# Altium project Sistem Tasarim.PrjPcb
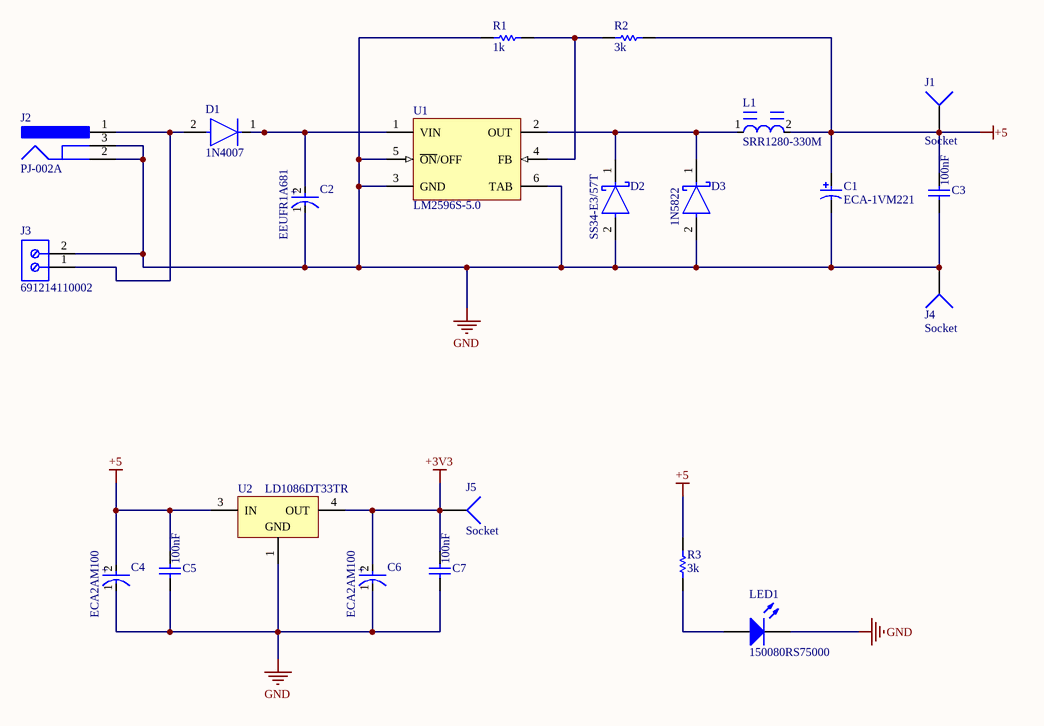
[diagram p0: Power_Supply.SchDoc]
8 sheets, 102 parts. Net scope: global (net labels, ports and power ports of the same name join across sheets).
Board file: Sistem Tasarim PCB.PcbDoc
Sheets:
  Power_Supply.SchDoc
  MCU.SchDoc
  Leds and Buttons.SchDoc
  Buzzer and Relay.SchDoc
  Distance and PhotoElectric.SchDoc
  ADC Channels.SchDoc
  Oled Display and Bluetooth Sensor.SchDoc
  DC Engine and Servo Engine.SchDoc

## Sheet Power_Supply.SchDoc
size A; SheetNumber: 1; SheetTotal: 8; SPICEModelCachePQJKFEOE: <root> / <DocumentId>PQJKFEOE</DocumentId> / </root>

### Parts
C1  ECA-1VM221  [PNSC-ECA-1VM221-2]
C2  EEUFR1A681  [FP-RAD-TH-D_8_0_5-L_11_5-MFG]
C3  value 100nF  [CAPC2013X135X45LL10T25]  (hidden comment: GRM21BR71H105KA12L)
C4  ECA2AM100  [FP-RAD-TH-D_5_0_5-L_11_1-MFG]
C5  value 100nF  [CAPC2013X135X45LL10T25]  (hidden comment: GRM21BR71H105KA12L)
C6  ECA2AM100  [FP-RAD-TH-D_5_0_5-L_11_1-MFG]
C7  value 100nF  [CAPC2013X135X45LL10T25]  (hidden comment: GRM21BR71H105KA12L)
D1  1N4007  [FP-1N4007-MFG]
D2  SS34-E3/57T  [FP-95402-MFG]
D3  1N5822  [FP-DO-201AD-MFG]
J1  Socket  [PIN1]
J2  PJ-002A  [CUI-PJ-002A_V]
J3  691214110002  [691214110002]
J4  Socket  [PIN1]
J5  Socket  [PIN1]
L1  SRR1280-330M  [FP-SRR1280-MFG]
LED1  150080RS75000  [0805_A]
R1  value 1k  [RESC2013X70X40NL20T20]  (hidden comment: ERJ6ENF47R0V)
R2  value 3k  [RESC2013X70X40NL20T20]  (hidden comment: ERJ6ENF47R0V)
R3  value 3k  [RESC2013X70X40NL20T20]  (hidden comment: ERJ6ENF47R0V)
U1  LM2596S-5.0  [KTT0005B_L]
U2  LD1086DT33TR  [TO-252_L]

### Nets
+3V3: C6.2(A) C7.2 J5.1 U2.4(OUT)
+5: C1.1 C3.2 C4.2(A) C5.2 J1.1 L1.2 R2.2 R3.2 U2.3(IN)
GND: C1.2 C2.1(C) C3.1 C4.1(C) C5.1 C6.1(C) C7.1 D2.2(A) D3.2(A) J2.2 J2.3 J3.2 J4.1 LED1.1(K) R1.1 U1.3(GND) U1.5(~{ON}/OFF) U1.6(TAB) U2.1(GND)
NetC2_2: C2.2(A) D1.1(C) U1.1(VIN)
NetD1_2: D1.2(A) J2.1 J3.1
NetD2_1: D2.1(C) D3.1(C) L1.1 U1.2(OUT)
NetLED1_2: LED1.2(A) R3.1
NetR1_2: R1.2 R2.1 U1.4(FB)

### Notes on the sheet
- (in symbol CMP-05427-000255-1) +
- (in symbol CMP-05427-000869-1) +

### Library data of the parts
C1 = CMP-2000-05311-1: Aluminum Electrolytic Capacitor, 220 uF, +/- 20%, 35 V, -40 to 85 degC, 2-Pin THD, RoHS, Bulk; Manufacturer: Panasonic; Lifetime@Temperature: 2000Hrs@85degC; Rated Voltage: 35V; Ripple Current: 350mA; Type: Radial; Capacitance: 220µF; Package Reference: ECA-1VM221; Series: M; Operating Temp Range: -40to+85degC; Package Description: 2-Pin Axial Lead, Dia 8 mm, Body Length 12.5 mm; Datasheet Version: Mar-06; Datasheet URL: https://datasheet.ciiva.com/26341/441851-da-01-en-elko-eca1vm221-m-r-220myf-35v-85c-26341906.pdf; Operating Temp-Max: 85degC; Case Size/Dimension: Ø8x11.5mm; Manufacturer URL: http://www.panasonic.com/
C2 = CMP-05427-000255-1: Aluminum Electrolytic Capacitors (Radial Lead Type) 680uF ±20% 10V; Ripple Current (AC): 950mA; Lead/Base Style: Straight; Lead Diameter: 0.6mm; Impedance: 56mR; Life (Hours): 6000Hour; Radiation Hardening: No; Height - Seated (Max): 0.512inch; Voltage Rating (DC): 10V; REACH SVHC: No SVHC; Termination: Radial; Length: 11.5mm; Series: FR; Packaging: Bulk; Lead Pitch: 3.5mm; Construction: RADIAL; Min Operating Temperature: -40°C; Height: 11.5mm; Contact Plating: Tin; Diameter: 8mm; Capacitance: 680uF; Max Operating Temperature: 105°C; Tolerance: 20%; Voltage: 10V; Package Quantity: 200; Case/Package: Radial; Voltage Rating: 10V; RoHS Compliant: Yes; Mount: Through Hole; ESR (Equivalent Series Resistance): 56mR; Ripple Current: 950mA; Lead Free: Lead Free; Number of Pins: 2
C3 C5 C7 = CMP-1036-04761-2: Manufacturer: Murata; Part Number: GRM21BR71H105KA12L
C4 C6 = CMP-05427-000869-1: Aluminum Electrolytic Capacitors (Radial Lead Type) 10uF ±20% 100V; Polarity: Polar; Lead Diameter: 0.5mm; Dissipation Factor: 0.1%; Leakage Current: 3uA; Dielectric Material: Aluminium; Ripple Current: 70mA; Life (Hours): 2000Hour; Lead/Base Style: Straight; Length: 11mm; Case/Package: Radial; Lead Pitch: 2mm; Contact Plating: Tin; RoHS Compliant: Yes; Radiation Hardening: No; Capacitance: 10uF; Max Operating Temperature: 85°C; Lead Free: Lead Free; Termination: Radial; Voltage Rating: 100V; Package Quantity: 200; Voltage: 100V; Construction: RADIAL; Height: 11mm; Min Operating Temperature: -40°C; Diameter: 5mm; REACH SVHC: No SVHC; Tolerance: 20%; Width: 5mm; Height - Seated (Max): 0.472inch; Mount: Through Hole; Series: M; Voltage Rating (DC): 100V; Packaging: Bulk; Ripple Current (AC): 70mA; Number of Pins: 2
D1 = CMP-123542-000001-1: Rectifier diode 1000 V 1 A DO-41, ,; Manufacturer: Diotec; Max Surge Forward Current: 27A; Forward Current: 1A; Max Junction Temp: +175°C; Reverse Voltage: 1000V; Value: 15pF; Peak Reverse Current: 5uA; Category: Diode; Temperature Range Low: -50°C; Automotive: No; Temperature: -50°C to +175°C; Lead Free: Yes; ComponentLink2Description: Datasheet; Max Repetitive Reverse Voltage: 1000V; ComponentLink2URL: https://datasheet.octopart.com/1N4007-Diotec-datasheet-62346875.pdf; Manufacturer Part Number: 1N4007; Device Class L3: Rectifier Diodes; Height: 2.8mm; Octopart: https://octopart.com/1n4007-diotec-4040411; Package: 1N4007; Temperature Range High: +175°C; Device Class L1: Discrete Semiconductors; Device Class L2: Diodes; RoHS: TRUE; Capacitance: 15pF; Ipc Land Pattern Name: DIOAD888W100L520D280
D2 = CMP-02539-000012-1: DIODE SCHOTTKY 40V 3A DO214AB; Manufacturer: Vishay; Max Junction Temp: +150°C; Peak Reverse Current: 0.5mA; Max Surge Forward Current: 100A; Standoff Height: 0mm; ComponentLink2Description: Datasheet; Device Class L3: Schottky Diodes; Height: 2.62mm; Max Repetitive Reverse Voltage: 40V; Lead Free: Yes; Package: 95402; Temperature Range High: +150°C; ComponentLink2URL: http://www.vishay.com/docs/88751/ss32.pdf; Temperature: -55°C to +150°C; Footprint Url: http://www.vishay.com/docs/95402/smc.pdf; Automotive: No; Forward Current: 3A; Category: Diode; Manufacturer Part Number: SS34-E3/57T; RoHS: TRUE; Device Class L2: Diodes; Mouser Description: Schottky Diodes & Rectifiers 3.0 Amp 40 Volt; Octopart: https://octopart.com/ss34-e3%2F57t-vishay-39552907; Temperature Range Low: -55°C; Device Class L1: Discrete Semiconductors; Digikey Description: DIODE SCHOTTKY 40V 3A DO214AB
D3 = CMP-12187-000025-1: DIODE SCHOTTKY 40V 3A DO201AD; Manufacturer: STMicroelectronics; Max Junction Temp: +150°C; Peak Reverse Current: 2mA; Max Surge Forward Current: 80A; Temperature Range High: +150°C; Automotive: No; RoHS: TRUE; ComponentLink2Description: Datasheet; Manufacturer Part Number: 1N5822; Lead Free: Yes; Octopart: https://octopart.com/1n5822-stmicroelectronics-323225; Device Class L2: Diodes; Max Repetitive Reverse Voltage: 40V; Temperature: to +150°C; Height: 5.3mm; Category: Diode; Digikey Description: DIODE SCHOTTKY 40V 3A DO201AD; ComponentLink2URL: https://www.st.com/resource/en/datasheet/1n5822.pdf; Device Class L3: Schottky Diodes; Device Class L1: Discrete Semiconductors; Forward Current: 3A; Mouser Description: Schottky Diodes & Rectifiers Vr/40V Io/3A BULK; Package: DO-201AD
J2 = CMP-2000-06895-2: Through Hole Right Angle DC Power Jack, 2.5 A, 2 mm Center Pin, 3 Position, -25 to 85 degC, RoHS, Bulk; Manufacturer: CUIInc.; Brand: CUI; Inside Contact Diameter: 2mm; Voltage Rating: 24V; Outside Contact Diameter: 6.5mm; Current Rating: 2.5A; Insulation Resistance: 50MOhms; Contact Gender: Male; Connector Type: DCPowerJack; Datasheet Version: Rev. 1.03, 04/2016; Housing Material: PolybutyleneTerephthalate(PBT); Operating Temperature Range: -25Cto+85C; Termination Style: ThroughHole; Product Category: DCPowerConnectors; Mounting Technology: ThroughHole; Mounting Style: ThroughHole; Factory Pack Quantity: 500; Contact Plating: Nickel; Package Reference: PJ-002A; Mounting Angle: Right; Package Description: 3-Pin Through Hole Device, Body 14.4 x 9 mm, Height 11 mm; Flammability Rating: UL94V-0; Manufacturer URL: http://www.cui.com/; Product: Jacks; Contact Material: Copper; Datasheet URL: http://www.cui.com/product/resource/pj-002a.pdf; RoHS: True
J3 = CMP-1502-02464-1: Serie 2141 - 3.50 mm Horizontal Entry Modular with Rising Cage Clamp WR-TBL, 2 pin; Manufacturer: Wurth Elektronik; Pin Number: 2; Pitch: 3.50mm; Datasheet URL: http://katalog.we-online.de/em/datasheet/6912141100xx.pdf; Packaging: Box; Mounting Technology: THT; Package Reference: 691214110002; Manufacturer URL: http://www.we-online.de; Part Number: 691214110002; Publisher: WurthElektronik; Operating Temperature: -40to105degC
L1 = CMP-2000-07148-2: FIXED IND 33UH 3.5A 57 MOHM SMD; Self Resonant Frequency: 9.5MHz; Saturation Current: 3.3A; Shielding: Shielded; Test Frequency: 100kHz; Core Material: Ferrite; Tolerance: 20%; Q Factor: 28; Resistance: 57MR; Material: Steel; RMS Current (Irms): 3.5A; Max DC Current: 3.5A; Height: 7.5mm; Frequency: 9.5MHz; Series: SRR1280; Length: 12.5mm; Military Standard: Not; Height - Seated (Max): 0.315inch; REACH SVHC: No SVHC; Inductance: 33uH; DC Current: 3.5A; Current Rating: 3.5A; Sample Rate (Hz): 100kHz; Min Operating Temperature: -40°C; RoHS Compliant: Yes; Width: 12.5mm; Packaging: Tape and Reel; Inductance Tolerance: 20%; Case/Package: Nonstandard; Radiation Hardening: No; Max Operating Temperature: 125°C; Number of Pins: 2; Depth: 12.8mm; Mount: Surface Mount; Termination: SMD/SMT; Package Quantity: 400; DC Resistance (DCR): 57mR; Resistor Type: Wirewound
LED1 = CMP-1426-00011-1: SMD mono-color Chip LED, WL-SMCW, Red; Manufacturer: Wuerth Elektronik; Color: Red; PartNumber: 150080RS75000; PackageReference: 0805_A; ComponentLink2Description: Datasheet; ComponentLink1URL: http://www.we-online.com; ComponentLink1Description: Manufacturer URL; ComponentLink2URL: http://katalog.we-online.com/led/datasheet/150080RS75000.pdf
R1-R3 = CMP-2001-00205-1: Manufacturer: Panasonic; Part Number: ERJ6ENF47R0V
U1 = CMP-0069-00270-3: SIMPLE SWITCHER® Power Converter 150 KHz 3A Step-Down Voltage Regulator, 5-pin TO-263; Manufacturer: Texas Instruments; PowerWise: N; PackageTopMarking: NSUZXYTTE#*LM2596S*-5.0 P+; RoHS: N; Code_JEDEC: MO-169-AB; PackageDescription: TO-263, Molded, .400 x .390 x .180in, 5 Lead, .067in Pitch, Surface Mount; PinCount: 5; PackageReference: KTT0005B; CompType: Switcher; ComponentLink1URL: http://www.ti.com/general/docs/lit/getliterature.tsp?genericPartNumber=LM2596&fileType=pdf; ComponentLink1Description: Datasheet URL
U2 = CMP-0244-00125-1: 1.5A, Low Drop Positive Voltage Regulator, 3.3V, 3-Pin DPAK, Tape and Reel; ComponentLink2URL: http://www.st.com/internet/com/TECHNICAL_RESOURCES/TECHNICAL_LITERATURE/DATASHEET/CD00001884.pdf; ComponentLink1URL: http://www.st.com; PackageReference: TO-252; ComponentLink1Description: Manufacturer URL; ComponentLink2Description: Datasheet; PackageVersion: 2011; PackageDescription: 3-Pin Transistor Outline Package 2.28 mm Pitch, 9.7 mm Lead Span (DPAK); DatasheetVersion: 11/07/2011
J1 J4 J5 = Socket: LatestRevisionDate: 17-Jul-2002; LatestRevisionNote: Re-released for DXP Platform.; Publisher: Altium Limited

## Sheet MCU.SchDoc
size A; SheetNumber: 2; SheetTotal: 8
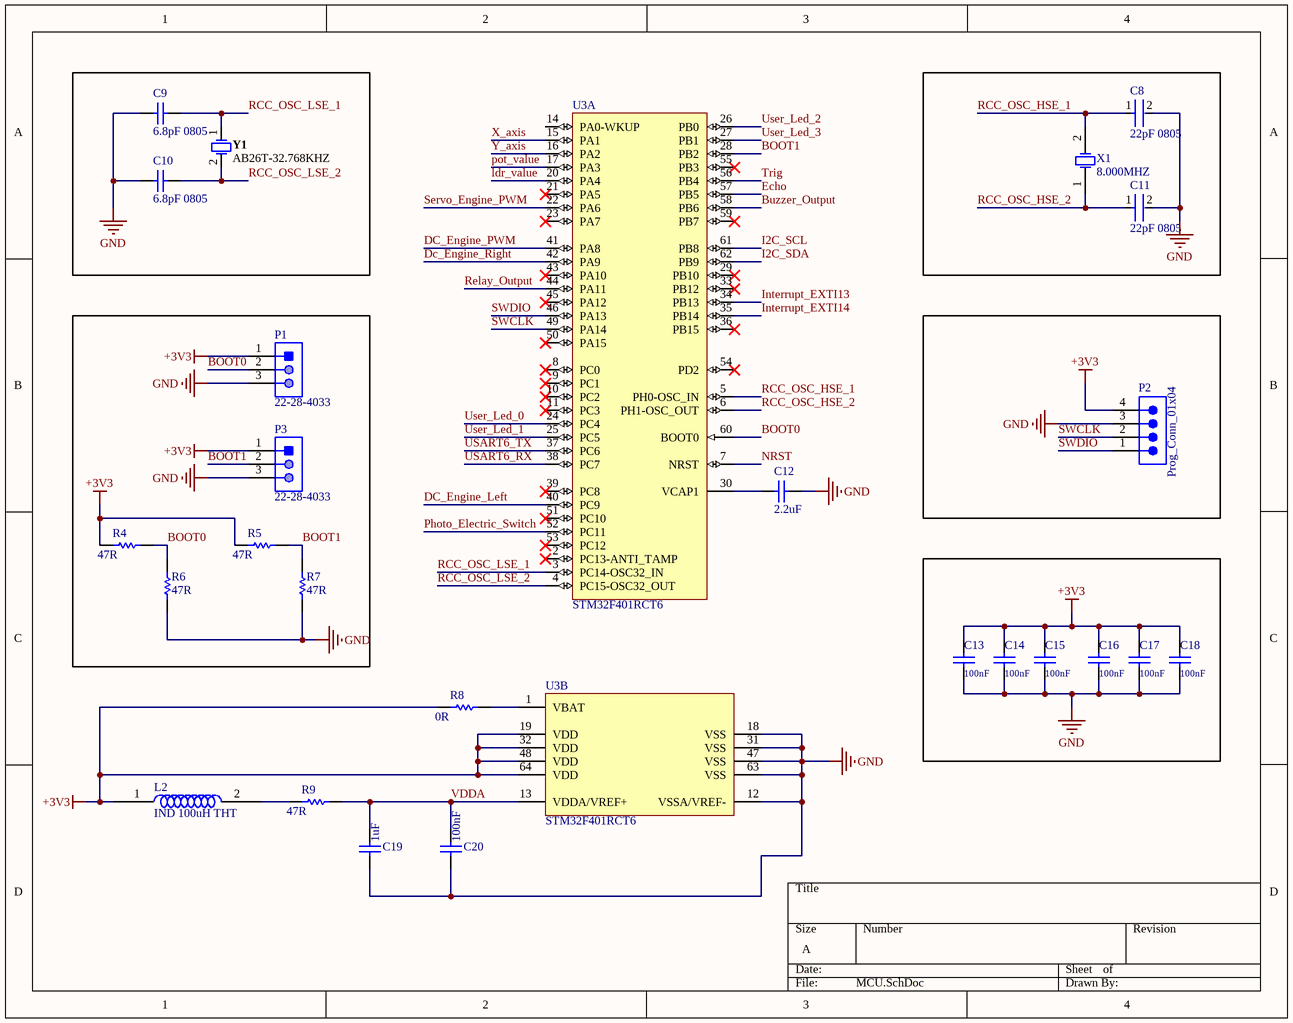
[diagram p1: MCU.SchDoc]

### Parts
C8  22pF 0805  [FP-C0805C-DN-MFG]
C9  6.8pF 0805  [CAPC0805(2012)75_N]
C10  6.8pF 0805  [CAPC0805(2012)75_N]
C11  22pF 0805  [FP-C0805C-DN-MFG]
C12  value 2.2uF  [CAPC2013X135X45LL10T25]  (hidden comment: GRM21BR71H105KA12L)
C13  value 100nF  [CAPC2013X135X45LL10T25]  (hidden comment: GRM21BR71H105KA12L)
C14  value 100nF  [CAPC2013X135X45LL10T25]  (hidden comment: GRM21BR71H105KA12L)
C15  value 100nF  [CAPC2013X135X45LL10T25]  (hidden comment: GRM21BR71H105KA12L)
C16  value 100nF  [CAPC2013X135X45LL10T25]  (hidden comment: GRM21BR71H105KA12L)
C17  value 100nF  [CAPC2013X135X45LL10T25]  (hidden comment: GRM21BR71H105KA12L)
C18  value 100nF  [CAPC2013X135X45LL10T25]  (hidden comment: GRM21BR71H105KA12L)
C19  value 1uF  [CAPC2013X135X45LL10T25]  (hidden comment: GRM21BR71H105KA12L)
C20  value 100nF  [CAPC2013X135X45LL10T25]  (hidden comment: GRM21BR71H105KA12L)
L2  IND 100uH THT  [INDUCTOR THT]
P1  22-28-4033  [MOLX-22-28-4033_V]
P2  Prog_Conn_01x04  [SMTC-TSW-104-08-X-S]
P3  22-28-4033  [MOLX-22-28-4033_V]
R4  value 47R  [RESC2013X70X40NL20T20]  (hidden comment: ERJ6ENF47R0V)
R5  value 47R  [RESC2013X70X40NL20T20]  (hidden comment: ERJ6ENF47R0V)
R6  value 47R  [RESC2013X70X40NL20T20]  (hidden comment: ERJ6ENF47R0V)
R7  value 47R  [RESC2013X70X40NL20T20]  (hidden comment: ERJ6ENF47R0V)
R8  value 0R  [RESC2013X70X40NL20T20]  (hidden comment: ERJ6ENF47R0V)
R9  value 47R  [RESC2013X70X40NL20T20]  (hidden comment: ERJ6ENF47R0V)
U3  STM32F401RCT6  [STM-LQFP64_N]  (parts A,B of 2)
X1  8.000MHZ  [ABRA-ABLS-14.7456MHZ-B2-T_V]
Y1  AB26T-32.768KHZ  [ABRA-AB26T]

### Nets
+3V3: C13.2 C14.2 C15.2 C16.2 C17.2 C18.2 L2.1 P1.1 P2.4 P3.1 R4.1 R5.1 R8.1 U3.19(VDD) U3.32(VDD) U3.48(VDD) U3.64(VDD)
GND: C8.2 C9.1 C10.1 C11.2 C12.1 C13.1 C14.1 C15.1 C16.1 C17.1 C18.1 C19.1 C20.1 P1.3 P2.3 P3.3 R6.1 R7.1 U3.12(VSSA/VREF-) U3.18(VSS) U3.31(VSS) U3.47(VSS) U3.63(VSS)
BOOT0: P1.2 R4.2 R6.2 U3.60(BOOT0)
BOOT1: P3.2 R5.2 R7.2 U3.28(PB2)
Buzzer_Output: U3.58(PB6)
DC_Engine_Left: U3.40(PC9)
DC_Engine_PWM: U3.41(PA8)
Dc_Engine_Right: U3.42(PA9)
Echo: U3.57(PB5)
I2C_SCL: U3.61(PB8)
I2C_SDA: U3.62(PB9)
Interrupt_EXTI13: U3.34(PB13)
Interrupt_EXTI14: U3.35(PB14)
ldr_value: U3.20(PA4)
NRST: U3.7(NRST)
Photo_Electric_Switch: U3.52(PC11)
pot_value: U3.17(PA3)
RCC_OSC_HSE_1: C8.1 U3.5(PH0-OSC_IN) X1.2(X2)
RCC_OSC_HSE_2: C11.1 U3.6(PH1-OSC_OUT) X1.1(X1)
RCC_OSC_LSE_1: C9.2 U3.3(PC14-OSC32_IN) Y1.1
RCC_OSC_LSE_2: C10.2 U3.4(PC15-OSC32_OUT) Y1.2
Relay_Output: U3.44(PA11)
Servo_Engine_PWM: U3.22(PA6)
SWCLK: P2.2 U3.49(PA14)
SWDIO: P2.1 U3.46(PA13)
Trig: U3.56(PB4)
USART6_RX: U3.38(PC7)
USART6_TX: U3.37(PC6)
User_Led_0: U3.24(PC4)
User_Led_1: U3.25(PC5)
User_Led_2: U3.26(PB0)
User_Led_3: U3.27(PB1)
VDDA: C19.2 C20.2 R9.2 U3.13(VDDA/VREF+)
X_axis: U3.15(PA1)
Y_axis: U3.16(PA2)
NetC12_2: C12.2 U3.30(VCAP1)
NetL2_2: L2.2 R9.1
NetR8_2: R8.2 U3.1(VBAT)

Not connected (* = marked no-connect by the designer): U3 2(PC13-ANTI_TAMP)* 8(PC0)* 9(PC1)* 10(PC2)* 11(PC3)* 14(PA0-WKUP) 21(PA5)* 23(PA7)* 29(PB10)* 33(PB12)* 36(PB15)* 39(PC8)* 43(PA10)* 45(PA12)* 50(PA15)* 51(PC10)* 53(PC12)* 54(PD2)* 55(PB3)* 59(PB7)*

### Library data of the parts
C8 C11 = CMP-2007-00466-2: CAP CER 22PF 50V 10% NP0 0805; Manufacturer Part Number: C0805C220K5GACTU; Manufacturer: KEMET; Material: Ceramic; Tolerance: 0.1; Temperature Coefficient: 30ppm/°C; Temperature Characteristic: C0G; Lead Free: Yes; Device Class L2: Capacitors; Voltage Rating: 50 V; Package: C0805C-DN; Mouser Description: Multilayer Ceramic Capacitors MLCC - SMD/SMT 50volts 22pF C0G 10%; ComponentLink2URL: https://content.kemet.com/datasheets/KEM_C1003_C0G_SMD.pdf; Ipc Land Pattern Name: CAPC200125X78; Capacitance: 22 pF; Temperature Range Low: -55°C; Device Class L1: Passive Components; Octopart: https://octopart.com/c0805c220k5gactu-kemet-9138623; ComponentLink2Description: Datasheet; Device Class L3: Ceramic Capacitors; Temperature Range High: +125°C; Height: 0.88mm; RoHS: TRUE; Temperature: -55°C to +125°C; Category: Cap; Automotive: No; Digikey Description: CAP CER 22PF 50V 10% NP0 0805; Value: 22 pF
C9 C10 = CMP-1036-00687-1: CAP 6.8pF 25V ±0.25pF 0805 (2012 Metric) Thickness 0.75mm SMD; Tolerance: Â±0.25pF; Case-EIA: 0805; Case-Metric: 2012; Value: 6.8pF; Technology: SMT; Max Thickness: 0.75 mm; Rated Voltage: 25 V
C12-C20 = CMP-1036-04761-2: Manufacturer: Murata; Part Number: GRM21BR71H105KA12L
L2 = IND 100uH THT: Fixed Ind 100uH THT
P1 P3 = CMP-1676-00001-5: Male Header, Pitch 2.54 mm, 1 x 3 Position, Height 8.38 mm, Tail Length 3.18 mm, RoHS, Bulk; Manufacturer: Molex; Rows: 1; Voltage Rating: 250 V; Current Rating: 4 A; Min Operating Temperature: 0 degC; Lead Pitch: 0.1 inch; Packaging: Bulk; Contact Finish: Gold; RoHSCompliant: true; Contact Material: Brass; PackageReference: 22-28-4033; REACH SVHC: Unknown; PackageDescription: Male Header, Pitch 2.54 mm, 1 x 3 Position, Height 8.38 mm, Tail Length 3.18 mm; ComponentLink2URL: http://www.molex.com/pdm_docs/sd/022284033_sd.pdf; Height: 8.38 mm; Mounting Technology: Through Hole; ComponentLink1Description: Manufacturer URL; Length: 7.62 mm; Mount: Through Hole; DatasheetVersion: Rev. G, 01/2012; Max Operating Temperature: 75 degC; ComponentLink2Description: Datasheet; Colour: Black; Pins: 3; Contact Plating: Gold; Package Quantity: 1; ComponentLink1URL: http://www.molex.com/
P2 = CMP-1024-00356-1: 0.025" SQ Post Header, Through-hole, Vertical, -55 to 105 degC, 2.54 mm Pitch, 4-Pin, Male, RoHS; PartNumber: TSW-104-08-T-S; Manufacturer: Samtec; Pitch: 2.54 mm; PackageDescription: .025[0.64] SQ. Post Terminal Strip Assembly; ComponentLink2URL: http://www.samtec.com/documents/webfiles/pdf/TSW_TH.PDF; ComponentLink3URL: http://www.samtec.com/documents/webfiles/cpdf/TSW-XXX-XX-XXX-X-XX-XXX-MKT.pdf; PackageVersion: DM, 8/1988; ComponentLink3Description: Package Specification; DatasheetVersion: F-214; Orientation: Vertical; RoHS: True; Mounting Technology: Through-hole; ComponentLink1URL: http://www.samtec.com; ComponentLink1Description: Manufacturer URL; Temperature Range: -55 to 105 degC; ComponentLink2Description: Datasheet; PackageReference: TSW-104-08-X-S
R4-R9 = CMP-2001-00205-1: Manufacturer: Panasonic; Part Number: ERJ6ENF47R0V
U3 = CMP-0243-00091-2: ARM Cortex-M4 32-bit MCU+FPU, 105 DMIPS, 256 kB Flash, 64 kB Internal RAM, 48 I/Os, 64-pin LQFP, -40 to 85 degC, Tray; Manufacturer: STMicroelectronics; Internal RAM Size (kB): 64; Supply Voltage(Vcc) max (V): 3.6; FLASH Size (Prog) (kB): 256; I/Os (High Current): 48; Operating Frequency(F) (Processor speed) (MHz): 84; Supply Voltage(Vcc) min (V): 1.8; DatasheetVersion: Rev. 1; ComponentLink1URL: http://www.st.com/web/en/home.html; ComponentLink1Description: Manufacturer URL; PackageDescription: 64-Pin Low Profile Quad Flat Package, 10 x 10 mm Body, 0.5 mm Pitch; Packing: Tray; ComponentLink3URL: http://www.st.com/st-web-ui/static/active/en/resource/technical/document/datasheet/DM00037051.pdf; PackageVersion: Rev. 4, 06/2013; ComponentLink2URL: http://www.st.com/st-web-ui/static/active/en/resource/technical/document/data_brief/DM00071938.pdf; PartNumber: STM32F401RCT6; PackageReference: LQFP64; Mounting Technology: Surface Mount; ComponentLink2Description: Datasheet; ComponentLink3Description: Package Specification; Core: ARM Cortex-M4
X1 = CMP-2000-05726-1: Low Profile Crystal, 8.0 MHz, +/- 30 ppm, -20 to 70 degC, 2-Pin SMD, RoHS, Tape and Reel; Brand: ABRACON; Case Length: 11.4mm; Frequency Stability: 50PPM; ESR: 80Ohms; Case Height: 4.2mm; Tolerance: 30PPM; Frequency: 8MHz; Case Width: 4.7mm; Load Capacitance: 18pF; Datasheet Version: 04/2011; Termination Style: SMD/SMT; Dimensions: 4.7mmWx11.4mmLx4.2mmH; Packaging: Reel; Manufacturer: ABRACON; Package URL: http://www.abracon.com/Support/PackageDrawing/Resonators/ABLS-2D.pdf; Mounting Technology: SurfaceMount; Package Reference: ABLS-14.7456MHZ-B2-T; Product Category: Crystals; Package Description: 2-Pin Surface Mount Device, Body 11.4 x 4.7 mm; Package / Case: HC-49/US; Mounting Style: SMD/SMT; Operating Temperature Range: -20Cto+70C; Series: ABLS; Factory Pack Quantity: 1000; Datasheet URL: http://www.abracon.com/Resonators/abls.pdf; Manufacturer URL: http://www.abracon.com/; RoHS: Details; Type: LowProfileMicroprocessorCrystal
Y1 = CMP-2000-05723-1: Crystal, 12.5 pF, 32.768 KHz, -10 to 60 degC, 2-Pin THD, RoHS, Bulk; Manufacturer: ABRACON; ESR: 35kOhms; Frequency Stability: -0.034PPM; Load Capacitance: 12.5pF; Tolerance: 20PPM; Case Length: 6.2mm; Case Diameter: 2.1mm; RoHS: Details; Product Category: Crystals; Type: WatchCrystal; Manufacturer URL: http://www.abracon.com/; Operating Temperature Range: -10Cto+60C; Package Description: 2-Pin Through Hole Device, Dia 2.1 mm, Body Length 6.2 mm; Termination Style: Radial; Datasheet Version: 06/2010; Datasheet URL: http://www.abracon.com/Resonators/AB26T.pdf; Packaging: Bulk; Factory Pack Quantity: 500; Brand: ABRACON; Mounting Technology: ThroughHole; Package URL: http://www.abracon.com/Support/PackageDrawing/Resonators/AB26T.PDF; Package / Case: Cylinder; Lead Spacing: 0.8mm; Dimensions: 2.1mmDia.x6.2mmL; Mounting Style: ThroughHole; Frequency: 32.768kHz; Package Reference: AB26T; Series: AB26T

## Sheet Leds and Buttons.SchDoc
size A; SheetNumber: 3; SheetTotal: 7
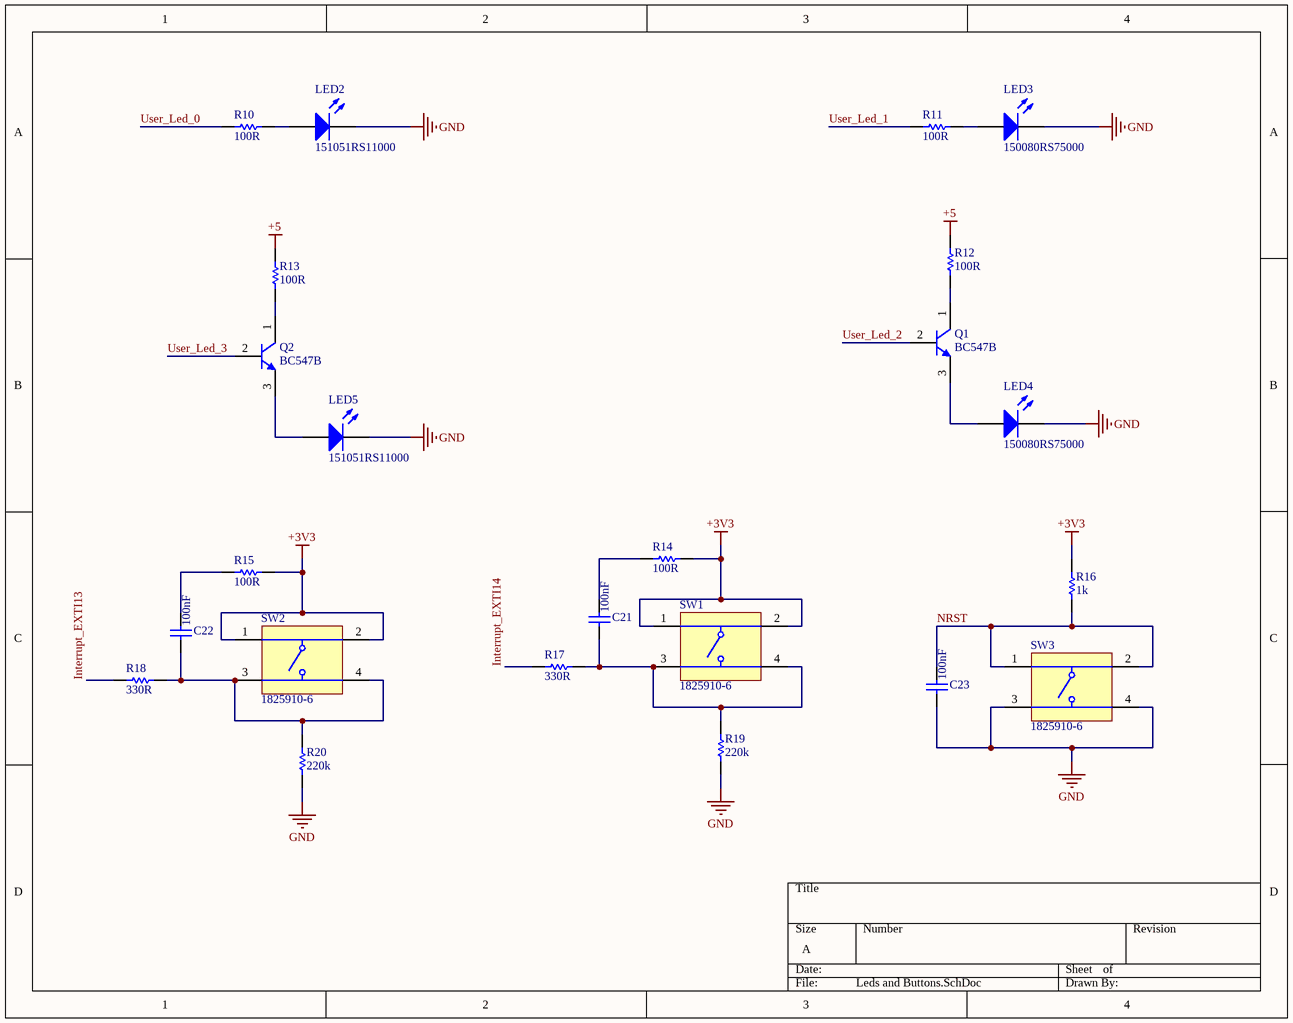
[diagram p2: Leds and Buttons.SchDoc]

### Parts
C21  value 100nF  [CAPC2013X135X45LL10T25]  (hidden comment: GRM21BR71H105KA12L)
C22  value 100nF  [CAPC2013X135X45LL10T25]  (hidden comment: GRM21BR71H105KA12L)
C23  value 100nF  [CAPC2013X135X45LL10T25]  (hidden comment: GRM21BR71H105KA12L)
LED2  151051RS11000  [Type 5mm]
LED3  150080RS75000  [0805_A]
LED4  150080RS75000  [0805_A]
LED5  151051RS11000  [Type 5mm]
Q1  BC547B  [ONSC-TO-92-3-29-11]
Q2  BC547B  [ONSC-TO-92-3-29-11]
R10  value 100R  [RESC2013X70X40NL20T20]  (hidden comment: ERJ6ENF47R0V)
R11  value 100R  [RESC2013X70X40NL20T20]  (hidden comment: ERJ6ENF47R0V)
R12  value 100R  [RESC2013X70X40NL20T20]  (hidden comment: ERJ6ENF47R0V)
R13  value 100R  [RESC2013X70X40NL20T20]  (hidden comment: ERJ6ENF47R0V)
R14  value 100R  [RESC2013X70X40NL20T20]  (hidden comment: ERJ6ENF47R0V)
R15  value 100R  [RESC2013X70X40NL20T20]  (hidden comment: ERJ6ENF47R0V)
R16  value 1k  [RESC2013X70X40NL20T20]  (hidden comment: ERJ6ENF47R0V)
R17  value 330R  [RESC2013X70X40NL20T20]  (hidden comment: ERJ6ENF47R0V)
R18  value 330R  [RESC2013X70X40NL20T20]  (hidden comment: ERJ6ENF47R0V)
R19  value 220k  [RESC2013X70X40NL20T20]  (hidden comment: ERJ6ENF47R0V)
R20  value 220k  [RESC2013X70X40NL20T20]  (hidden comment: ERJ6ENF47R0V)
SW1  1825910-6  [TECO-1825910-6_V]
SW2  1825910-6  [TECO-1825910-6_V]
SW3  1825910-6  [TECO-1825910-6_V]

### Nets
+3V3: R14.2 R15.2 R16.2 SW1.1 SW1.2 SW2.1 SW2.2
+5: R12.1 R13.1
GND: C23.1 LED2.1(K) LED3.1(K) LED4.1(K) LED5.1(K) R19.1 R20.1 SW3.3 SW3.4
Interrupt_EXTI13: R18.1
Interrupt_EXTI14: R17.1
NRST: C23.2 R16.1 SW3.1 SW3.2
User_Led_0: R10.1
User_Led_1: R11.1
User_Led_2: Q1.2(B)
User_Led_3: Q2.2(B)
NetC21_1: C21.1 R17.2 R19.2 SW1.3 SW1.4
NetC21_2: C21.2 R14.1
NetC22_1: C22.1 R18.2 R20.2 SW2.3 SW2.4
NetC22_2: C22.2 R15.1
NetLED2_2: LED2.2(A) R10.2
NetLED3_2: LED3.2(A) R11.2
NetLED4_2: LED4.2(A) Q1.3(E)
NetLED5_2: LED5.2(A) Q2.3(E)
NetQ1_1: Q1.1(C) R12.2
NetQ2_1: Q2.1(C) R13.2

### Library data of the parts
C21-C23 = CMP-1036-04761-2: Manufacturer: Murata; Part Number: GRM21BR71H105KA12L
LED2 LED5 = CMP-1488-00008-1: THT LED round mono-color color lens, WL-TMRW, Red; Manufacturer: Wuerth Elektronik; PackageReference: Type 5mm; PartNumber: 151051RS11000; ComponentLink2URL: http://katalog.we-online.de/pbs/datasheet/7448042001.pdfhttp://katalog.we-online.de/pbs/datasheet/7448042001.pdfhttp://katalog.we-online.de/pbs/datasheet/7448042001.pdfhttp://katalog.we-online.de/pbs/datasheet/151051RS11000.pdf; ComponentLink1URL: http://www.we-online.com; ComponentLink1Description: Manufacturer URL; ComponentLink2Description: Datasheet; Emitting color: Red
LED3 LED4 = CMP-1426-00011-1: as LED1 on sheet Power_Supply; Color: Red; PartNumber: 150080RS75000; PackageReference: 0805_A; ComponentLink2Description: Datasheet; ComponentLink1URL: http://www.we-online.com; ComponentLink1Description: Manufacturer URL; ComponentLink2URL: http://katalog.we-online.com/led/datasheet/150080RS75000.pdf
Q1 Q2 = CMP-1048-01467-1: Amplifier Transistor, NPN Silicon, 3-Pin TO-92, Bulk Box; Manufacturer: On Semiconductor; IC Continuous (A): 0.1; fT Min (MHz): 150; DatasheetVersion: Rev. 7; ComponentLink1URL: http://www.onsemi.com/; Polarity: NPN; RoHS: FALSE; ComponentLink1Description: Manufacturer URL; Packing: Bulk Box; PackageDescription: 3-Pin Transistor Outline, Body 4.825 x 3.685 mm, Pitch 1.27 mm; ComponentLink3URL: http://www.onsemi.cn/pub_link/Collateral/2N6426-D.PDF; ComponentLink2Description: Datasheet; PackageVersion: Rev. AM; PackageReference: TO-92-3-29-11_AM_SL; ComponentLink3Description: Package Specification; Mounting Technology: Through Hole; PartNumber: BC547B; ComponentLink2URL: http://www.onsemi.com/pub_link/Collateral/BC546-D.PDF
R10-R20 = CMP-2001-00205-1: Manufacturer: Panasonic; Part Number: ERJ6ENF47R0V
SW1-SW3 = CMP-1684-00021-1: Tact Switch, SPST-NO, 0.05 A, -35 to 85 degC, 4-Pin THD, RoHS, Bulk; Manufacturer: TE Connectivity; Maximum Contact Resistance: 100mOhm; Mechanical Life: 100000Cycles; Bushing Type: Unthreaded; Switch Configuration: OFF(ON); Maximum DC Voltage Rating: 24V; Contact Rating @ Voltage: 0.05A@24VDC; Actuator Color: Black; Body Orientation: Straight; Function: MomentaryContact; Illumination: N/R; Actuator Style: RoundButton; Actuator Material: PolybutyleneTerephthalate; Dielectric Strength: 500VAC; Pole Throw Configuration: SPST; Actuator Length: 1.4mm; Product Weight: N/A; Contact Material: CopperAlloy; Housing Material: N/A; Terminal Type: PCPins; Minimum Insulation Resistance: 100MOhm; Package Description: 4-Pin Through Hole Device, Body 5.99 x 5.99 mm, Pitch 6.5 mm; Part No: 1825910-6; Package Reference: THD; Base Material: N/A; Manufacturer URL: http://www.te.com; Contact Plating: Silver; RoHS: Yes; Datasheet Version: Rev. C9; Electrical Life: 100000Cycles; Maximum AC Voltage Rating: N/A; Thread Size: N/R; Operating Temperature: -35to85C; Mounting: ThroughHole; Dimension: 5.99x5mm; Datasheet URL: http://www.te.com/commerce/DocumentDelivery/DDEController?Action=showdoc&DocId=Customer+Drawing%7F1825910%7FC9%7Fpdf%7FEnglish%7FENG_CD_1825910_C9.pdf%7F1825910-6; Family: 1825910; Seal Location: N/A; Seal Description: N/A; Packaging: N/A

## Sheet Buzzer and Relay.SchDoc
size A; SheetNumber: 4; SheetTotal: 8; SPICEModelCacheVCIOZCSS: <root> / <DocumentId>VCIOZCSS</DocumentId> / </root>
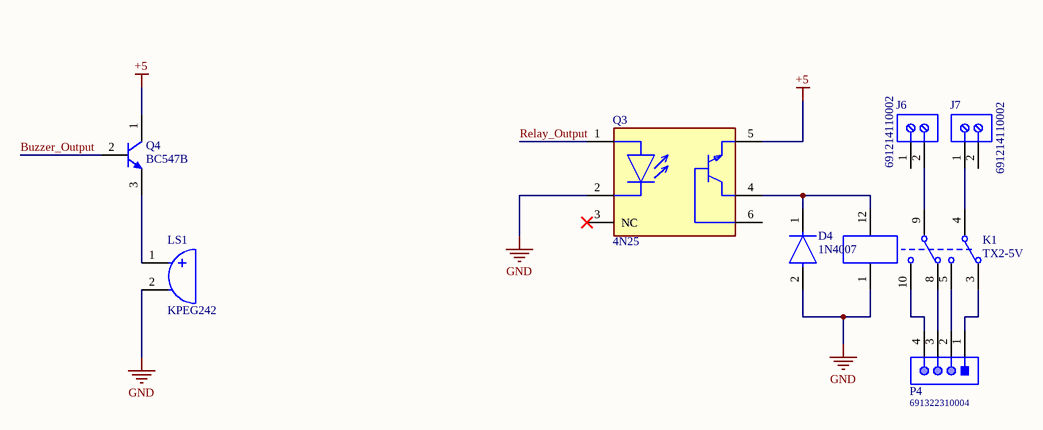
[diagram p3: Buzzer and Relay.SchDoc]

### Parts
D4  1N4007  [FP-1N4007-MFG]
J6  691214110002  [691214110002]
J7  691214110002  [691214110002]
K1  TX2-5V  [PNSC-TX2-5V_V]
LS1  KPEG242  [KINGS-KPEG242-2]
P4  691322310004  [691322310004]
Q3  4N25  [FP-4N25-MFG]
Q4  BC547B  [ONSC-TO-92-3-29-11]

### Nets
+5: Q3.5(C) Q4.1(C)
GND: D4.2(A) K1.1 LS1.2 Q3.2(C)
Buzzer_Output: Q4.2(B)
Relay_Output: Q3.1(A)
NetD4_1: D4.1(C) K1.12 Q3.4(E)
NetJ6_2: J6.2 K1.9
NetJ7_1: J7.1 K1.4
NetK1_3: K1.3 P4.1
NetK1_5: K1.5 P4.2
NetK1_8: K1.8 P4.3
NetK1_10: K1.10 P4.4
NetLS1_1: LS1.1 Q4.3(E)

Not connected (* = marked no-connect by the designer): J6 1; J7 2; Q3 3(NC)* 6(B)

### Library data of the parts
D4 = CMP-123542-000001-1: as D1 on sheet Power_Supply; Category: Diode; Temperature Range Low: -50°C; Automotive: No; Temperature: -50°C to +175°C; Lead Free: Yes; ComponentLink2Description: Datasheet; Max Repetitive Reverse Voltage: 1000V; ComponentLink2URL: https://datasheet.octopart.com/1N4007-Diotec-datasheet-62346875.pdf; Manufacturer Part Number: 1N4007; Device Class L3: Rectifier Diodes; Height: 2.8mm; Octopart: https://octopart.com/1n4007-diotec-4040411; Package: 1N4007; Temperature Range High: +175°C; Device Class L1: Discrete Semiconductors; Device Class L2: Diodes; RoHS: TRUE; Capacitance: 15pF; Ipc Land Pattern Name: DIOAD888W100L520D280
J6 J7 = CMP-1502-02464-1: as J3 on sheet Power_Supply; Datasheet URL: http://katalog.we-online.de/em/datasheet/6912141100xx.pdf; Packaging: Box; Mounting Technology: THT; Package Reference: 691214110002; Manufacturer URL: http://www.we-online.de; Part Number: 691214110002; Publisher: WurthElektronik; Operating Temperature: -40to105degC
K1 = CMP-2000-07334-1: 2000 V AC Breakdown Voltage, 2 Form C and 2 A Relay, Coil Votage 5 V, 28.1 mA, 178 Ohm, 140 mW, -40 to 85 degC, 8-Pin THD, RoHS, Tube; Manufacturer: Panasonic; Coil Resistance: 178ohm; Contact Current Min: 10µA; Coil Operating Upper Percent Limit: 150%; Approval Category: EN41003; Coil Voltage VDC Nom: 5V; External Width: 7.4mm; Nom Operating Power: 140mW; Approval Bodies: CSA/UL; Contact Current DC Max: 2A; Contact Voltage DC Nom: 30V; Coil Current: 28.1mA; Contact Voltage AC Max: 125V; Operating Time: 4ms; Contact Configuration: DPCO; Contact Current AC Max: 500mA; Relay Type: GeneralPurpose; External Height: 15mm; Contact Voltage AC Nom: 250V; External Depth: 8.2mm; PCB Hole Diameter: 1mm; No. of Poles: 2; Relay Mounting: ThroughHole; SVHC: NoSVHC(19-Dec-2012); Coil Type: DC; Coil Operating Lower Percent Limit: 75%; Manufacturer URL: http://www.panasonic.com/; Contact Material: SilverAlloy,GoldClad; Mounting Type: PCB; Package Reference: TX2-5V; Operating Temperature Min: -40°C; Datasheet URL: http://www3.panasonic.biz/ac/e_download/control/relay/signal/catalog/mech_eng_tx.pdf?f_cd=302302; Contact Voltage DC Max: 30V; Contact Current Max: 2A; Operating Temperature Max: 85°C; Coil Power Cont: 140mW; Contact Plating: Gold; DC Coil Power: 140mW; Datasheet Version: 07/2014; Package Description: 8-Pin Through Hole Relay, Body 15 x 7.4 mm; External Length / Height: 15mm; Mounting Technology: ThroughHole; Lead Spacing: 2.54mm
LS1 = CMP-2000-06518-1: Piezo Indicator, 4100 Hz, 3 to 16 V, -20 to 70 degC, 2-Pin THD, RoHS; PartNumber: KPE-242; Manufacturer: KingstateElectronicsCorp.; Frequency Range: 3600to4600Hz; Maximum Supply Current: 7mA; Typical Operating Supply Voltage: 12Vdc; Product Height: 7.6mm; Current - Max: 7A; Tone Mode: Continuous; Product Diameter: 13.7mm; Minimum Sound Pressure: 70dBA; Maximum Resonant Frequency: 4600Hz; Type: Indicator; Datasheet URL: https://datasheet.ciiva.com/11776/0900766b8068f3a2-11776713.pdf; Mounting: ThroughHole; Technology: Piezo; Operating Temperature: -20to70°C; Category: AudioIndicatorsandAlerts; Termination Method: Pin; Manufacturer URL: http://www.kingstate.com.tw/index.php/en/; Package Description: 2-Pin Through Hole Device, Body Dia 13.7 mm, Pitch 7.62 mm; Datasheet Version: 01/2006; Package Reference: KPEG242; Mounting Technology: ThroughHole
P4 = CMP-1502-01888-1: Serie 322 - 3.81mm Horizontal PCB Header WR-TBL, 4 pin; Manufacturer: Wurth Elektronik; Gender: Male; Pin Number: 4; Package Reference: 691322310004; Part Number: 691322310004; Publisher: WurthElektronik; Packaging: Box; Mounting Technology: THT; Manufacturer URL: http://www.we-online.de; Operating Temperature: -40to105degC; Pitch: 3.81mm; Datasheet URL: http://katalog.we-online.de/em/datasheet/6913223100xx.pdf
Q3 = CMP-22018-000009-1: OPTOISO 2.5KV TRANS W/BASE 6DIP; Isolation Voltage: 5kV; Reverse Breakdown Voltage: 5V; Forward Voltage: 1.5V; Rise Time: 2us; Max Power Dissipation: 250mW; Collector Emitter Breakdown Voltage: 30V; Max Collector Current: 100mA; Collector Emitter Saturation Voltage: 500mV; Power Dissipation: 150mW; Number of Elements: 1; Forward Current: 60mA; Output Voltage: 70V; Input Type: DC; Max Input Current: 80mA; Input Current: 50mA; Current Transfer Ratio: 50%; Number of Pins: 6; Min Operating Temperature: -55°C; Radiation Hardening: No; Case/Package: PDIP; Fall Time: 2us; Lead Free: Lead Free; Series: -; Max Operating Temperature: 100°C; Output Current per Channel: 100mA; Number of Circuits: 1; Collector Emitter Voltage (VCEO): 30V; Isolation Voltage-Max: 5kV; Collector-emitter Voltage-Max: 500mV; Packaging: Rail/Tube; Mount: Through Hole; Package Quantity: 2000; Max Output Voltage: 30V; Number of Channels: 1
Q4 = CMP-1048-01467-1: as Q1 on sheet Leds and Buttons; DatasheetVersion: Rev. 7; ComponentLink1URL: http://www.onsemi.com/; Polarity: NPN; RoHS: FALSE; ComponentLink1Description: Manufacturer URL; Packing: Bulk Box; PackageDescription: 3-Pin Transistor Outline, Body 4.825 x 3.685 mm, Pitch 1.27 mm; ComponentLink3URL: http://www.onsemi.cn/pub_link/Collateral/2N6426-D.PDF; ComponentLink2Description: Datasheet; PackageVersion: Rev. AM; PackageReference: TO-92-3-29-11_AM_SL; ComponentLink3Description: Package Specification; Mounting Technology: Through Hole; PartNumber: BC547B; ComponentLink2URL: http://www.onsemi.com/pub_link/Collateral/BC546-D.PDF

## Sheet Distance and PhotoElectric.SchDoc
size A; SheetNumber: 5; SheetTotal: 7
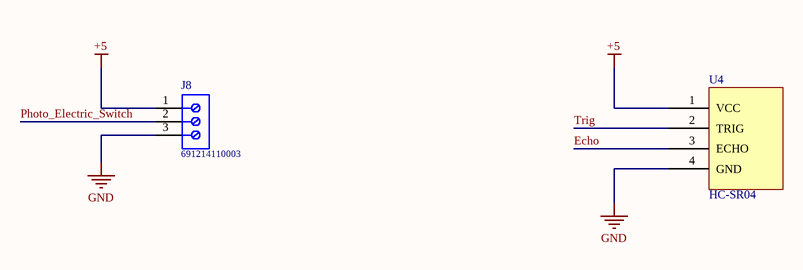
[diagram p4: Distance and PhotoElectric.SchDoc]

### Parts
J8  691214110003  [691214110003]
U4  HC-SR04  [HC-SR04]

### Nets
+5: J8.1 U4.1(VCC)
GND: J8.3 U4.4(GND)
Echo: U4.3(ECHO)
Photo_Electric_Switch: J8.2
Trig: U4.2(TRIG)

### Library data of the parts
J8 = CMP-1502-02466-1: Serie 2141 - 3.50 mm Horizontal Entry Modular with Rising Cage Clamp WR-TBL, 3 pin; Manufacturer: Wurth Elektronik; Pin Number: 3; Pitch: 3.50mm; Package Reference: 691214110003; Mounting Technology: THT; Part Number: 691214110003; Manufacturer URL: http://www.we-online.de; Packaging: Box; Operating Temperature: -40to105degC; Publisher: WurthElektronik; Datasheet URL: http://katalog.we-online.de/em/datasheet/6912141100xx.pdf
U4 = HC - SR04: 5V 15mA Distance Sensor THT Arduino Sensor

## Sheet ADC Channels.SchDoc
size A; SheetNumber: 6; SheetTotal: 8
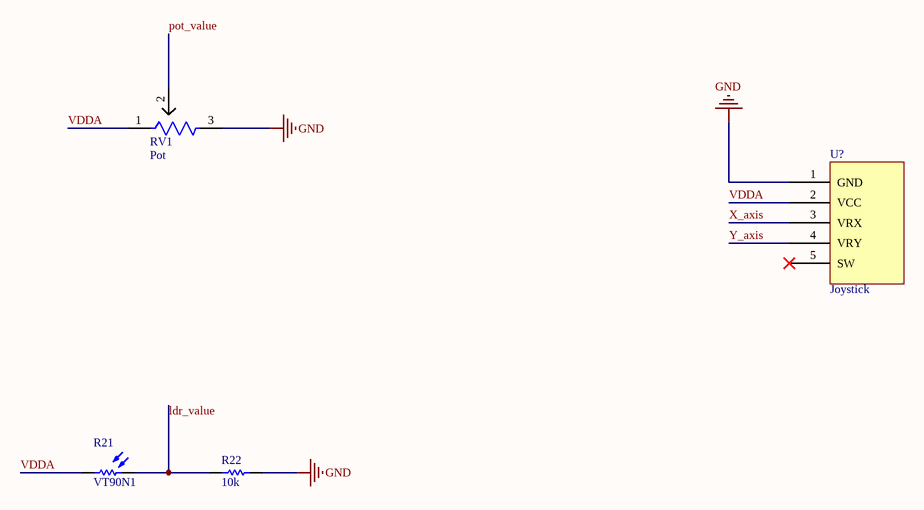
[diagram p5: ADC Channels.SchDoc]

### Parts
R21  VT90N1  [EXCE-VT90N1]
R22  value 10k  [RESC2013X70X40NL20T20]  (hidden comment: ERJ6ENF47R0V)
RV1  Pot  [Potansiyometre]
U?  Joystick  [Joystick]

### Nets
GND: R22.1 RV1.3 U?.1(GND)
ldr_value: R21.2 R22.2
pot_value: RV1.2
VDDA: R21.1 RV1.1 U?.2(VCC)
X_axis: U?.3(VRX)
Y_axis: U?.4(VRY)

Not connected (* = marked no-connect by the designer): U? 5(SW)*

### Library data of the parts
R21 = CMP-2000-07406-1: Photoconductive Resistor, 200 kOhm, 100 V, 80 mW, -40 to 75 degC, 2-Pin THD, RoHS; Manufacturer: Excelitas Technology; SVHC: Cadmiumchloride(15-Jun-2015); Power Rating: 80mW; Resistance @ Lux: 12kohm; Voltage Rating: 100V; Product Range: -; Datasheet Version: 09/2006; Resistor Case Style: -; Operating Temperature Max: 75°C; Package Reference: VT90N1; Datasheet URL: http://datasheet.octopart.com/VT90N1-Excelitas-datasheet-10388451.pdf; Mounting Technology: ThroughHole; Operating Temperature Min: -40°C; Dark Resistance: 200kohm; Package Description: 2-Pin Through Hole Device, Body Width 4.17 mm (Max), Height 2.29 mm; Manufacturer URL: http://www.excelitas.com/Pages/Index.aspx; Packaging: Each
R22 = CMP-2001-00205-1: Manufacturer: Panasonic; Part Number: ERJ6ENF47R0V
RV1 = Potansiyometre: 100K Potantiometer
U? = Joystick: 2 axial Joystick

## Sheet Oled Display and Bluetooth Sensor.SchDoc
size A; SheetNumber: 7; SheetTotal: 8
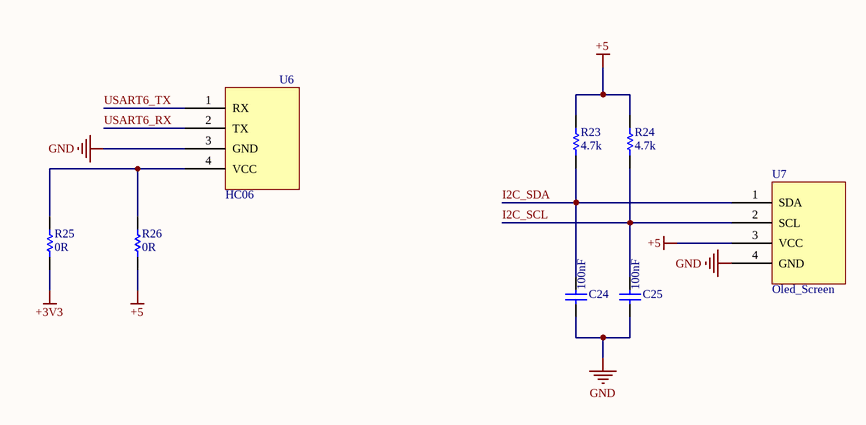
[diagram p6: Oled Display and Bluetooth Sensor.SchDoc]

### Parts
C24  value 100nF  [CAPC2013X135X45LL10T25]  (hidden comment: GRM21BR71H105KA12L)
C25  value 100nF  [CAPC2013X135X45LL10T25]  (hidden comment: GRM21BR71H105KA12L)
R23  value 4.7k  [RESC2013X70X40NL20T20]  (hidden comment: ERJ6ENF47R0V)
R24  value 4.7k  [RESC2013X70X40NL20T20]  (hidden comment: ERJ6ENF47R0V)
R25  value 0R  [RESC2013X70X40NL20T20]  (hidden comment: ERJ6ENF47R0V)
R26  value 0R  [RESC2013X70X40NL20T20]  (hidden comment: ERJ6ENF47R0V)
U6  HC06  [HC06]
U7  Oled_Screen  [Oled_Ekran]

### Nets
+3V3: R25.2
+5: R23.1 R24.1 R26.2 U7.3(VCC)
GND: C24.1 C25.1 U6.3(GND) U7.4(GND)
I2C_SCL: C25.2 R24.2 U7.2(SCL)
I2C_SDA: C24.2 R23.2 U7.1(SDA)
USART6_RX: U6.2(TX)
USART6_TX: U6.1(RX)
NetR25_1: R25.1 R26.1 U6.4(VCC)

### Library data of the parts
C24 C25 = CMP-1036-04761-2: Manufacturer: Murata; Part Number: GRM21BR71H105KA12L
R23-R26 = CMP-2001-00205-1: Manufacturer: Panasonic; Part Number: ERJ6ENF47R0V
U6 = HC06: HC06 Bluetooth Sensor
U7 = Oled Ekran: I2C Communication 0.96inch 5V Oled Screen

## Sheet DC Engine and Servo Engine.SchDoc
size A; SheetNumber: 8; SheetTotal: 7
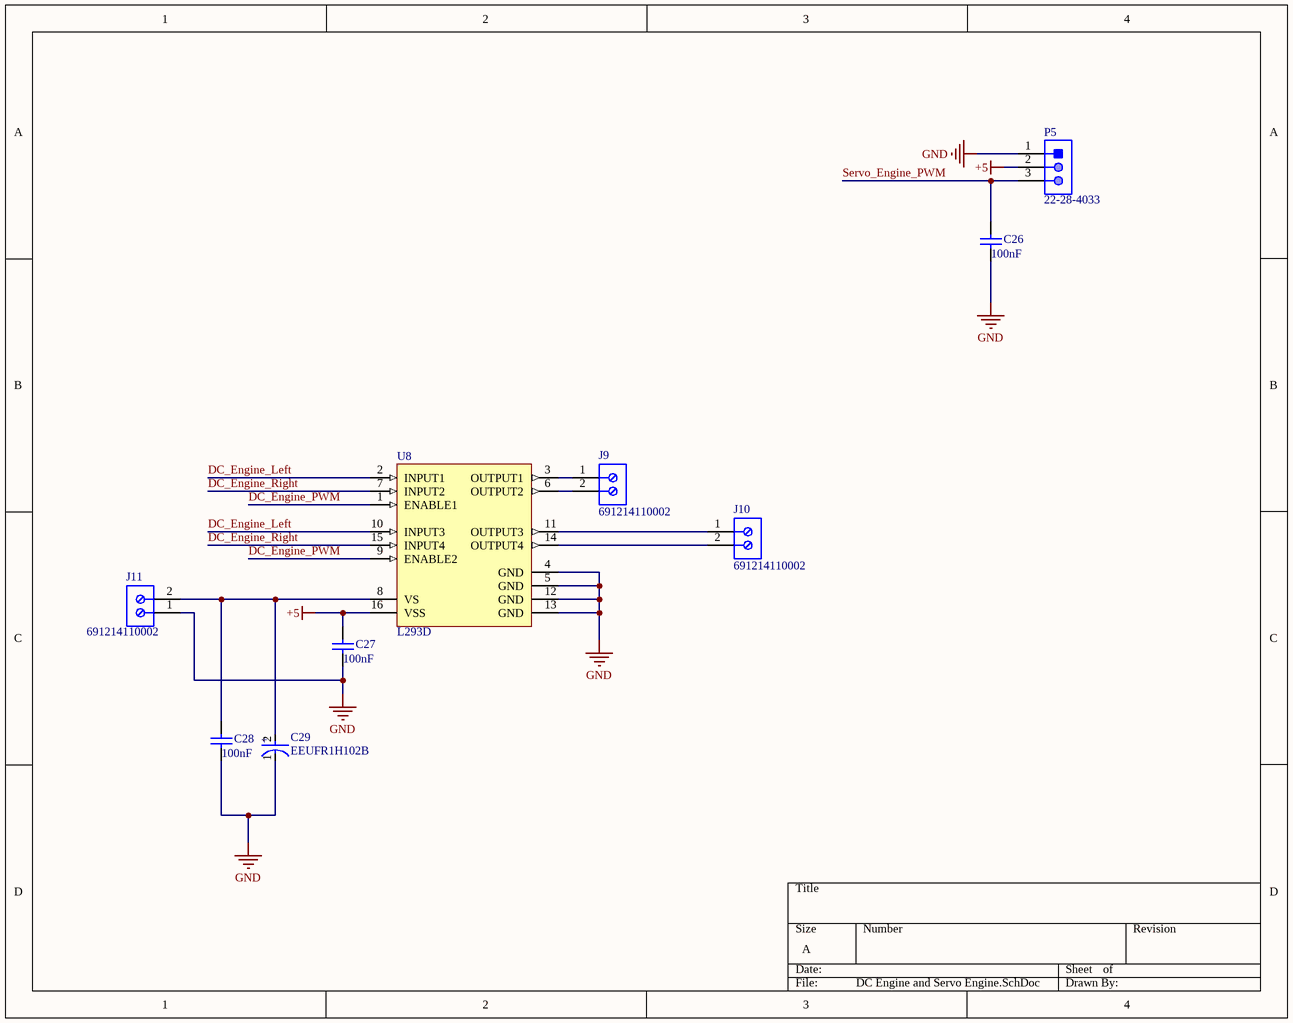
[diagram p7: DC Engine and Servo Engine.SchDoc]

### Parts
C26  value 100nF  [CAPC2013X135X45LL10T25]  (hidden comment: GRM21BR71H105KA12L)
C27  value 100nF  [CAPC2013X135X45LL10T25]  (hidden comment: GRM21BR71H105KA12L)
C28  value 100nF  [CAPC2013X135X45LL10T25]  (hidden comment: GRM21BR71H105KA12L)
C29  EEUFR1H102B  [FP-RAD-TH-D_16_0_5-L_25_2-MFG]
J9  691214110002  [691214110002]
J10  691214110002  [691214110002]
J11  691214110002  [691214110002]
P5  22-28-4033  [MOLX-22-28-4033_V]
U8  L293D  [STM-L293D-16]

### Nets
+5: C27.2 P5.2 U8.16(VSS)
GND: C26.1 C27.1 C28.1 C29.1(C) J11.1 P5.1 U8.4(GND) U8.5(GND) U8.12(GND) U8.13(GND)
DC_Engine_Left: U8.2(INPUT1) U8.10(INPUT3)
DC_Engine_PWM: U8.1(ENABLE1) U8.9(ENABLE2)
Dc_Engine_Right: U8.7(INPUT2) U8.15(INPUT4)
Servo_Engine_PWM: C26.2 P5.3
NetC28_2: C28.2 C29.2(A) J11.2 U8.8(VS)
NetJ9_1: J9.1 U8.3(OUTPUT1)
NetJ9_2: J9.2 U8.6(OUTPUT2)
NetJ10_1: J10.1 U8.11(OUTPUT3)
NetJ10_2: J10.2 U8.14(OUTPUT4)

### Notes on the sheet
- (in symbol CMP-05427-000487-1) +

### Library data of the parts
C26-C28 = CMP-1036-04761-2: Manufacturer: Murata; Part Number: GRM21BR71H105KA12L
C29 = CMP-05427-000487-1: Aluminum Electrolytic Capacitors (Radial Lead Type) 1000uF ±20% 50V; Ripple Current: 3.32A; Impedance: 16mR; Polarity: Polar; Life (Hours): 10000Hour; Capacitance: 1mF; Lead Diameter: 0.8mm; Mount: Through Hole; Series: FR; Package Quantity: 250; Length: 25mm; Radiation Hardening: No; REACH SVHC: No SVHC; Case/Package: Radial; Height: 25mm; Min Operating Temperature: -40°C; Contact Plating: Tin; Lead Free: Lead Free; Height - Seated (Max): 0.984inch; RoHS Compliant: Yes; Features: General Purpose; ESR (Equivalent Series Resistance): 16mR; Voltage Rating: 50V; Diameter: 16mm; Voltage Rating (DC): 50V; Max Operating Temperature: 105°C; Lead Pitch: 7.5mm; Packaging: Tape and Reel; Number of Pins: 2; Tolerance: 20%; Termination: Through Hole
J9-J11 = CMP-1502-02464-1: as J3 on sheet Power_Supply; Datasheet URL: http://katalog.we-online.de/em/datasheet/6912141100xx.pdf; Packaging: Box; Mounting Technology: THT; Package Reference: 691214110002; Manufacturer URL: http://www.we-online.de; Part Number: 691214110002; Publisher: WurthElektronik; Operating Temperature: -40to105degC
P5 = CMP-1676-00001-5: as P1 on sheet MCU; Min Operating Temperature: 0 degC; Lead Pitch: 0.1 inch; Packaging: Bulk; Contact Finish: Gold; RoHSCompliant: true; Contact Material: Brass; PackageReference: 22-28-4033; REACH SVHC: Unknown; PackageDescription: Male Header, Pitch 2.54 mm, 1 x 3 Position, Height 8.38 mm, Tail Length 3.18 mm; ComponentLink2URL: http://www.molex.com/pdm_docs/sd/022284033_sd.pdf; Height: 8.38 mm; Mounting Technology: Through Hole; ComponentLink1Description: Manufacturer URL; Length: 7.62 mm; Mount: Through Hole; DatasheetVersion: Rev. G, 01/2012; Max Operating Temperature: 75 degC; ComponentLink2Description: Datasheet; Colour: Black; Pins: 3; Contact Plating: Gold; Package Quantity: 1; ComponentLink1URL: http://www.molex.com/
U8 = CMP-2000-06524-1: Push-Pull Four Channel Driver with Diode, 4.5 to 36 V, -40 to 150 degC, 16-Pin PDIP, RoHS, Tube; Manufacturer: STMicroelectronics; Number of Outputs: 4; Current - Peak Output: 1.2A; Current - Output / Channel: 600mA; Input Type: Non-Inverting; Other Related Documents: L293DViewAllSpecifications; Dynamic Catalog: HalfBridge; Voltage - Supply: 4.5V~36V; Other Names: 497-2936-5; Package / Case: 16-DIP(0.300",7.62mm); PartNumber: L293D; Operating Temperature: -40°C~150°C; Datasheet URL: http://www.st.com/st-web-ui/static/active/en/resource/technical/document/datasheet/CD00000059.pdf; Supplier Device Package: 16-PowerDIP; Packaging: Tube; Package Description: 16-Pin Thru-Hole Dual-In-Line, Body 20 x 6.85 mm, Pitch 2.54 mm; Standard Package: 25; Datasheet Version: 07/2003; On-State Resistance: -; Manufacturer URL: http://www.st.com/; Category: IntegratedCircuits(ICs); Family: PMIC-MOSFET,BridgeDrivers-InternalSwitch; Type: HalfBridge; Series: -; Mounting Technology: ThroughHole; Package Reference: DIP-16; Mounting Type: ThroughHole

## Nets that join several sheets
+3V3: Power_Supply (C6.2 C7.2 J5.1 U2.4), MCU (17 pins), Leds and Buttons (7 pins), Oled Display and Bluetooth Sensor (R25.2)
+5: Power_Supply (9 pins), Leds and Buttons (R12.1 R13.1), Buzzer and Relay (Q3.5 Q4.1), Distance and PhotoElectric (J8.1 U4.1), Oled Display and Bluetooth Sensor (R23.1 R24.1 R26.2 U7.3), DC Engine and Servo Engine (C27.2 P5.2 U8.16)
GND: Power_Supply (19 pins), MCU (23 pins), Leds and Buttons (9 pins), Buzzer and Relay (D4.2 K1.1 LS1.2 Q3.2), Distance and PhotoElectric (J8.3 U4.4), ADC Channels (R22.1 RV1.3 U?.1), Oled Display and Bluetooth Sensor (C24.1 C25.1 U6.3 U7.4), DC Engine and Servo Engine (10 pins)
Buzzer_Output: MCU (U3.58), Buzzer and Relay (Q4.2)
DC_Engine_Left: MCU (U3.40), DC Engine and Servo Engine (U8.2 U8.10)
DC_Engine_PWM: MCU (U3.41), DC Engine and Servo Engine (U8.1 U8.9)
Dc_Engine_Right: MCU (U3.42), DC Engine and Servo Engine (U8.7 U8.15)
Echo: MCU (U3.57), Distance and PhotoElectric (U4.3)
I2C_SCL: MCU (U3.61), Oled Display and Bluetooth Sensor (C25.2 R24.2 U7.2)
I2C_SDA: MCU (U3.62), Oled Display and Bluetooth Sensor (C24.2 R23.2 U7.1)
Interrupt_EXTI13: MCU (U3.34), Leds and Buttons (R18.1)
Interrupt_EXTI14: MCU (U3.35), Leds and Buttons (R17.1)
ldr_value: MCU (U3.20), ADC Channels (R21.2 R22.2)
NRST: MCU (U3.7), Leds and Buttons (C23.2 R16.1 SW3.1 SW3.2)
Photo_Electric_Switch: MCU (U3.52), Distance and PhotoElectric (J8.2)
pot_value: MCU (U3.17), ADC Channels (RV1.2)
Relay_Output: MCU (U3.44), Buzzer and Relay (Q3.1)
Servo_Engine_PWM: MCU (U3.22), DC Engine and Servo Engine (C26.2 P5.3)
Trig: MCU (U3.56), Distance and PhotoElectric (U4.2)
USART6_RX: MCU (U3.38), Oled Display and Bluetooth Sensor (U6.2)
USART6_TX: MCU (U3.37), Oled Display and Bluetooth Sensor (U6.1)
User_Led_0: MCU (U3.24), Leds and Buttons (R10.1)
User_Led_1: MCU (U3.25), Leds and Buttons (R11.1)
User_Led_2: MCU (U3.26), Leds and Buttons (Q1.2)
User_Led_3: MCU (U3.27), Leds and Buttons (Q2.2)
VDDA: MCU (C19.2 C20.2 R9.2 U3.13), ADC Channels (R21.1 RV1.1 U?.2)
X_axis: MCU (U3.15), ADC Channels (U?.3)
Y_axis: MCU (U3.16), ADC Channels (U?.4)